# EAGLE design batt_monitor_6 (EAGLE 5.09)
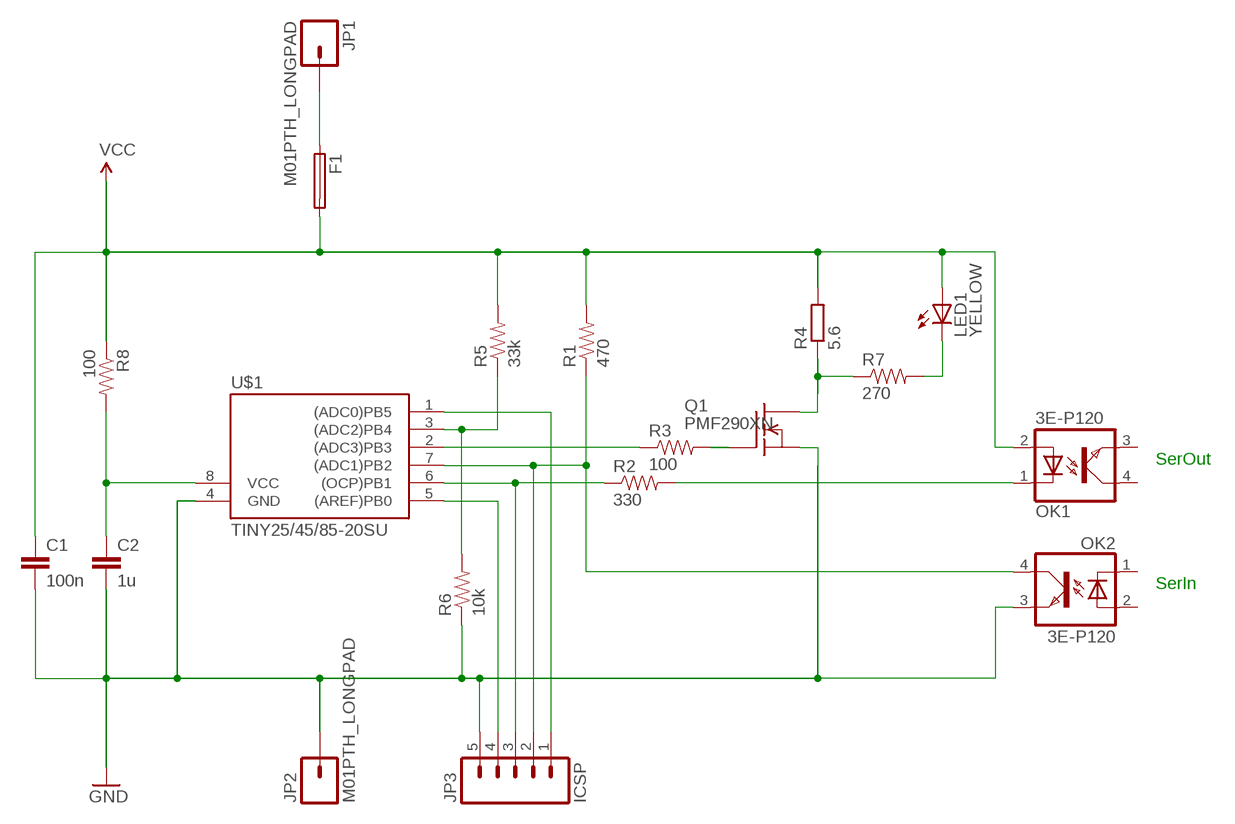
[diagram p0: schematic, sheet 1]

## Parts
C1  100n  CAP0805  [0805]
C2  1u  C-EUC1206  [C1206]
F1  TE5  [TE5]
JP1  M01PTH_LONGPAD  [1X01_LONGPAD]
JP2  M01PTH_LONGPAD  [1X01_LONGPAD]
JP3  ICSP  M05PTH  [1X05]
LED1  YELLOW  LED3MM  [LED3MM]
OK1  3E-P120  [SMD4]
OK2  3E-P120  [SMD4]
Q1  PMF290XN  [SOT23]
R1  470  RESISTOR  [0805]
R2  330  RESISTOR  [0805]
R3  100  RESISTOR  [0805]
R4  5.6  R-EU_0617/5V  [0617V]
R5  33k  RESISTOR  [0805]
R6  10k  RESISTOR  [0805]
R7  270  RESISTOR  [0805]
R8  100  RESISTOR  [0805]
U$1  TINY25/45/85-20SU  [SOIC8]

## Nets
GND: C1.2 C2.2 JP2.1 JP3.5 OK2.3(EMIT) Q1.2(S) R6.1 U$1.4(GND)
N$1: JP3.2 OK2.4(COL) R1.1 U$1.7((ADC1)PB2)
N$2: R3.1 U$1.2((ADC3)PB3)
N$3: OK1.1(C) R2.2
N$4: JP3.3 R2.1 U$1.6((OCP)PB1)
N$5: JP3.4 U$1.5((AREF)PB0)
N$6: JP3.1 U$1.1((ADC0)PB5)
N$7: Q1.1(G) R3.2
N$8: Q1.3(D) R4.1 R7.1
N$9: R5.1 R6.2 U$1.3((ADC2)PB4)
N$10: LED1.K(C) R7.2
N$11: C2.1 R8.2 U$1.8(VCC)
N$12: F1.1 JP1.1
VCC: C1.1 F1.2 LED1.A OK1.2(A) R1.2 R4.2 R5.2 R8.1
Unconnected: OK1.3(EMIT) OK1.4(COL) OK2.1(C) OK2.2(A)

## Notes on the sheet
- SerOut
- SerIn

## Library data of the parts
C1 = SparkFun:CAP: Capacitor Standard 0603 ceramic capacitor, and 0.1" leaded capacitor.
C2 = resistor:C-EU: CAPACITOR, European symbol
F1 = fuse:TE5: FUSE Wickmann
JP1 JP2 = SparkFun:M01: Header 1 Standard 1-pin 0.1" header. Use with straight break away headers (SKU : PRT-00116), right angle break away headers (PRT-00553), swiss pins (PRT-00743), machine pins (PRT-00117), and female headers (PRT-00115).
JP3 = SparkFun:M05: Header 5 Standard 5-pin 0.1" header. Use with straight break away headers (SKU : PRT-00116), right angle break away headers (PRT-00553), swiss pins (PRT-00743), machine pins (PRT-00117), and female headers (PRT-00115). Molex polarized connector foot print use with SKU : PRT-08230 with associated crimp pins and housings.
LED1 = SparkFun:LED: LEDs Standard schematic elements and footprints for 5mm, 3mm, 1206, and 0603 sized LEDs. 5mm - Spark Fun Electronics SKU : COM-00529 (and others)
OK1 OK2 = kng:3E-P120: OPTO COUPLER
Q1 = kng:PMF290: N-Channel Enhancement MOSFET 20V; 1A; 0,35Ohm
R1-R3 R5-R8 = SparkFun:RESISTOR: Resistor Basic schematic elements and footprints for 0603, 1206, and PTH 1/10th watt (small) resistors.
R4 = resistor:R-EU_: RESISTOR, European symbol
U$1 = avr-6:TINY25/45/85

## Board
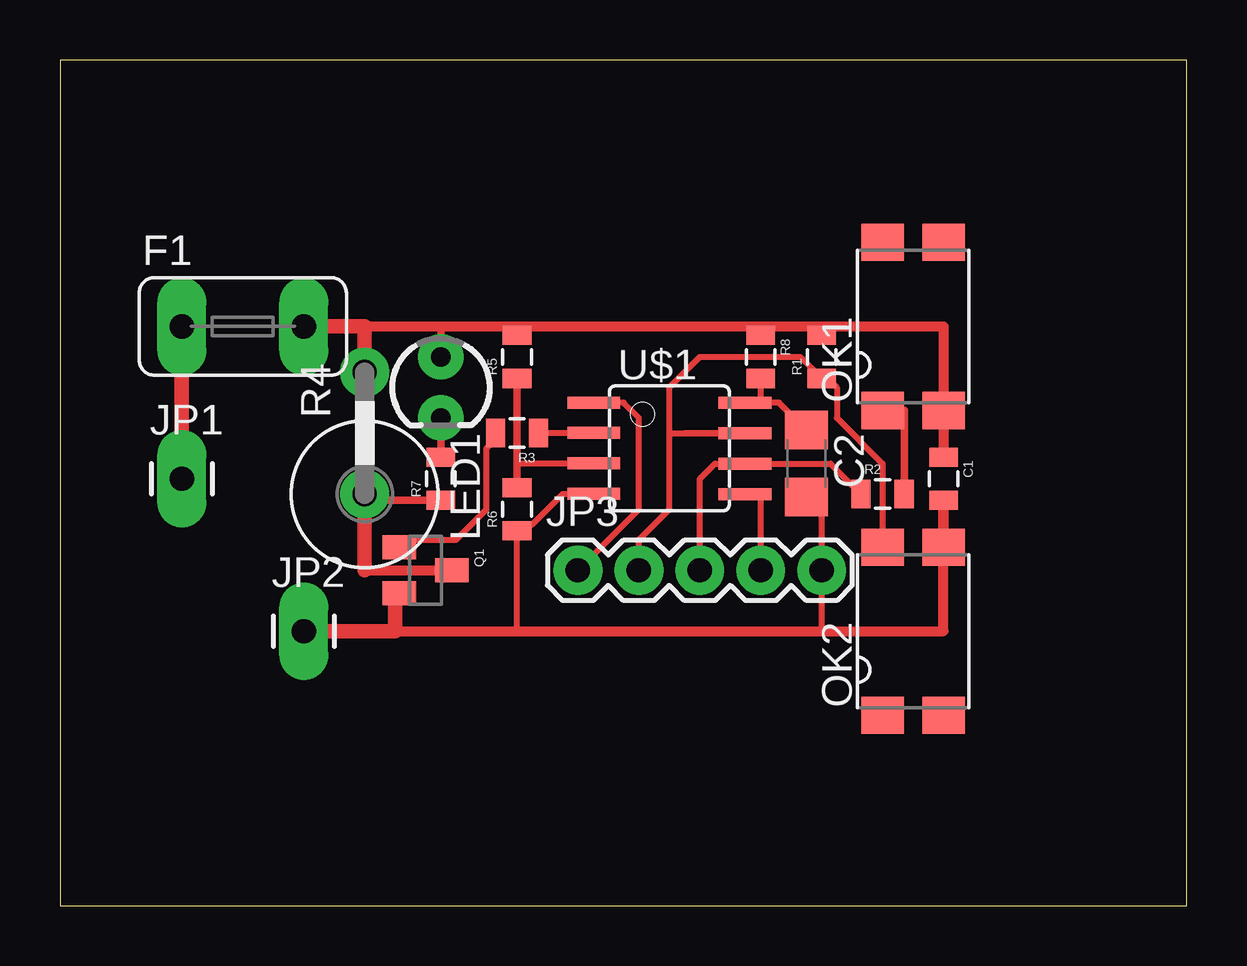
[diagram p1: board, top side]

Size 46.97 x 35.23 mm. Coordinates in mm from the lower left corner, seen from the top.
Outline: 0,0 46.97,0 46.97,35.23 0,35.23 0,0
Copper layers (1*16): Top 0.035mm / dielectric 1.5mm / Bottom 0.035mm
Design rules "kng": minimum track width 0.25mm, minimum drill 0.8mm, track to track 0.2mm, track to pad 0.2mm, pad to pad 0.2mm, via to via 0.2mm, smd to smd 0.2mm, copper to edge 1mm, drill to drill 0.2mm, minimum pad ring 0.4mm, minimum via ring 0.4mm, stop-mask expansion 0.15mm, vias tented up to drill 0mil, thermal gap 0.25mm

### Footprints (pad centres in the part's own frame; a part is rotated, then mirrored left to right if it is on the bottom)
0805 = smd 0.8 x 1.2: 1 -0.9,0; 2 0.9,0
C1206 = smd 1.6 x 1.8: 1 -1.4,0; 2 1.4,0
TE5 = drill 1.016 long: 1 -2.54,0; 2 2.54,0
1X01_LONGPAD = drill 1.016 pad 1.88 long: 1 0,0
1X05 = drill 1.016 pad 1.88 round: 1 0,0; 2 2.54,0; 3 5.08,0; 4 7.62,0; 5 10.16,0
LED3MM = drill 0.813 pad 1.88 round: A -1.27,0; K 1.27,0
SMD4 = smd 1.78 x 1.55: 1 -1.27,-3.5; 2 1.27,-3.5; 3 1.27,3.5; 4 -1.27,3.5
SOT23 = smd 1 x 1.4: 1 -0.95,-1.1; 2 0.95,-1.1; 3 0,1.1
0617V = drill 1.016 round: 1 -2.54,0; 2 2.54,0
SOIC8 = smd 0.5 x 2.2: 1 -1.905,-3.154; 2 -0.645,-3.154; 3 0.625,-3.154; 4 1.895,-3.154; 5 1.905,3.154; 6 0.635,3.154; 7 -0.635,3.154; 8 -1.905,3.154

### Placement (x,y rotation side)
C1  36.83,17.78 270 top
C2  31.11,18.41 270 top
F1  7.62,24.13 0 top
JP1  5.08,17.78 0 top
JP2  10.16,11.43 0 top
JP3  21.59,13.97 0 top
LED1  15.88,21.59 270 top
OK1  35.56,24.13 0 top
OK2  35.56,11.43 0 top
Q1  15.24,13.97 270 top
R1  31.75,22.86 90 top
R2  34.29,17.14 0 top
R3  19.05,19.68 180 top
R4  12.7,19.68 90 top
R5  19.05,22.86 90 top
R6  19.05,16.51 90 top
R7  15.88,17.78 90 top
R8  29.21,22.86 270 top
U$1  25.4,19.05 270 top

### Tracks (layer width: path | path; a pad name or v marks a point on that pad's centre or on a via)
GND
  Top 0.254: 31.75,11.43 JP3.5 31.75,16.51 C2.2 | U$1.4 20.96,17.16 19.68,15.88 19.32,15.88 R6.1 19.05,11.43
  Top 0.406: U$1.4 22.23,17.16 | OK2.3 C1.2 36.83,11.43 31.75,11.43 19.05,11.43 13.97,11.43
  Top 0.61: JP2.1 13.97,11.43 13.97,12.7 Q1.2
N$1
  Top 0.254: JP3.2 24.13,15.24 25.4,16.51 25.4,19.68 | 25.4,19.68 U$1.7 26.04,19.68 | 25.4,19.68 25.4,21.59 26.67,22.86 30.85,22.86 R1.1 32.02,21.96 32.38,21.59 32.38,20.32 34.29,18.41 OK2.4
N$2
  Top 0.254: 19.96,19.7 U$1.2
  Top 0.406: R3.1 19.96,19.7
N$3
  Top 0.305: OK1.1 35.19,20.63 R2.2
N$4
  Top 0.254: JP3.3 26.67,17.78 27.3,18.41 U$1.6 32.12,18.41 R2.1
N$5
  Top 0.254: JP3.4 29.21,17.14 U$1.5
N$6
  Top 0.254: U$1.1 23.5,20.95 24.13,20.32 24.13,16.51 JP3.1
N$7
  Top 0.254: R3.2 18.15,19.42 17.78,19.05 17.78,16.51 16.51,15.24 14.46,15.24 Q1.1
N$8
  Top 0.305: 12.7,16.88 R7.1
  Top 0.406: 12.7,13.97 Q1.3 | 12.7,16.51 12.7,16.88
  Top 0.61: 12.7,13.97 12.7,16.51 R4.1
N$9
  Top 0.254: U$1.3 19.06,18.43 19.05,18.41
  Top 0.305: R6.2 19.05,18.41 R5.1
N$10
  Top 0.305: R7.2 LED1.K
N$11
  Top 0.254: R8.2 29.21,20.95 U$1.8 29.98,20.95 C2.1
N$12
  Top 0.61: JP1.1 F1.1
VCC
  Top 0.254: 19.05,24.13 R5.2 | 29.21,24.13 R8.1 | 31.75,24.13 R1.2
  Top 0.305: 15.88,24.13 LED1.A
  Top 0.406: C1.1 OK1.2 36.83,24.13 31.75,24.13 29.21,24.13 19.05,24.13 15.88,24.13 F1.2
  Top 0.61: R4.2 12.7,24.13 F1.2